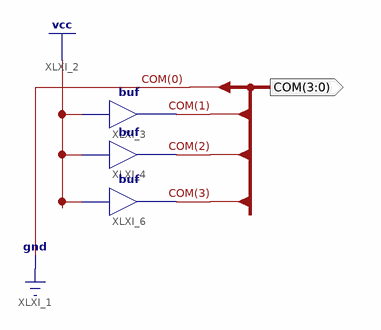
[diagram p0: schematic sheet 1]
// Xilinx ISE schematic test.sch (spartan6) as structural Verilog: 3 symbols, 1 ports
module test (
  output [3:0] COM
);

  buf XLXI_3 (COM[1], 1'b1);
  buf XLXI_4 (COM[2], 1'b1);
  buf XLXI_6 (COM[3], 1'b1);

  assign COM[0] = 1'b0;
endmodule
